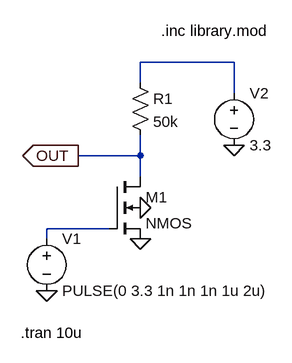
[diagram p0: schematic Draft7.asc]
Draft7.asc, the LTspice schematic file:
Version 4
SHEET 1 880 680
WIRE 192 128 48 128
WIRE 48 160 48 128
WIRE 192 176 192 128
WIRE 48 272 48 240
WIRE 48 272 -48 272
WIRE 48 304 48 272
WIRE 0 384 -96 384
WIRE -96 400 -96 384
FLAG -48 272 OUT
IOPIN -48 272 Out
FLAG 192 256 0
FLAG 48 352 0
FLAG -96 480 0
FLAG 48 400 0
SYMBOL res 32 144 R0
SYMATTR InstName R1
SYMATTR Value 50k
SYMBOL voltage -96 384 R0
WINDOW 123 0 0 Left 0
WINDOW 39 0 0 Left 0
SYMATTR InstName V1
SYMATTR Value PULSE(0 3.3 1n 1n 1n 1u 2u)
SYMBOL voltage 192 160 R0
WINDOW 123 0 0 Left 0
WINDOW 39 0 0 Left 0
SYMATTR InstName V2
SYMATTR Value 3.3
SYMBOL nmos4 0 304 R0
SYMATTR InstName M1
SYMATTR Value2 l=0.35u w=1.14u
TEXT 80 80 Left 2 !.inc library.mod
TEXT -136 544 Left 2 !.tran 10u

The netlist it stands for:
* Draft7.asc
R1 N001 OUT 50k
V1 N002 0 PULSE(0 3.3 1n 1n 1n 1u 2u)
V2 N001 0 3.3
M1 OUT N002 0 0 NMOS l=0.35u w=1.14u
.model NMOS NMOS
.model PMOS PMOS
.lib standard.mos
.inc library.mod
.tran 10u
.backanno
.end